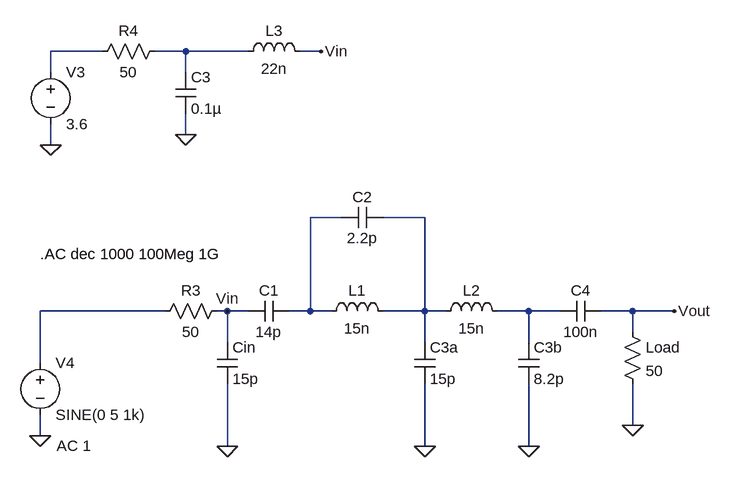
[diagram p0: schematic project front end 433.asc]
project front end 433.asc, the LTspice schematic file:
Version 4
SHEET 1 2444 680
WIRE 240 -224 160 -224
WIRE 368 -224 320 -224
WIRE 464 -224 368 -224
WIRE 576 -224 544 -224
WIRE 160 -192 160 -224
WIRE 368 -192 368 -224
WIRE 368 -96 368 -128
WIRE 160 -80 160 -112
WIRE 608 32 560 32
WIRE 736 32 672 32
WIRE 336 176 144 176
WIRE 432 176 416 176
WIRE 464 176 432 176
WIRE 560 176 560 32
WIRE 560 176 528 176
WIRE 592 176 560 176
WIRE 736 176 736 32
WIRE 736 176 672 176
WIRE 768 176 736 176
WIRE 896 176 848 176
WIRE 944 176 896 176
WIRE 1056 176 1008 176
WIRE 1120 176 1056 176
WIRE 1056 208 1056 176
WIRE 432 224 432 176
WIRE 736 224 736 176
WIRE 896 224 896 176
WIRE 144 256 144 176
WIRE 1056 352 1056 288
WIRE 144 368 144 336
WIRE 432 384 432 288
WIRE 736 384 736 288
WIRE 896 384 896 288
FLAG 736 384 0
FLAG 1056 352 0
FLAG 160 -80 0
FLAG 1120 176 Vout
FLAG 896 384 0
FLAG 432 384 0
FLAG 368 -96 0
FLAG 576 -224 Vin
FLAG 144 368 0
FLAG 432 176 Vin
SYMBOL cap 720 224 R0
SYMATTR InstName C3a
SYMATTR Value 15p
SYMBOL cap 464 192 R270
WINDOW 0 32 32 VTop 2
WINDOW 3 0 32 VBottom 2
SYMATTR InstName C1
SYMATTR Value 14p
SYMBOL cap 608 48 R270
WINDOW 0 32 32 VTop 2
WINDOW 3 0 32 VBottom 2
SYMATTR InstName C2
SYMATTR Value 2.2p
SYMBOL res 1040 192 R0
SYMATTR InstName Load
SYMATTR Value 50
SYMBOL voltage 160 -208 R0
WINDOW 123 25 143 Left 2
WINDOW 39 24 118 Left 2
SYMATTR InstName V3
SYMATTR Value 3.6
SYMBOL res 432 160 R90
WINDOW 0 0 56 VBottom 2
WINDOW 3 32 56 VTop 2
SYMATTR InstName R3
SYMATTR Value 50
SYMBOL ind 576 192 R270
WINDOW 0 32 56 VTop 2
WINDOW 3 5 56 VBottom 2
SYMATTR InstName L1
SYMATTR Value 15n
SYMBOL cap 880 224 R0
SYMATTR InstName C3b
SYMATTR Value 8.2p
SYMBOL cap 416 224 R0
SYMATTR InstName Cin
SYMATTR Value 15p
SYMBOL ind 752 192 R270
WINDOW 0 32 56 VTop 2
WINDOW 3 5 56 VBottom 2
SYMATTR InstName L2
SYMATTR Value 15n
SYMBOL ind 448 -208 R270
WINDOW 0 32 56 VTop 2
WINDOW 3 5 56 VBottom 2
SYMATTR InstName L3
SYMATTR Value 22n
SYMBOL cap 352 -192 R0
SYMATTR InstName C3
SYMATTR Value 0.1µ
SYMBOL voltage 144 240 R0
WINDOW 123 25 143 Left 2
WINDOW 39 24 118 Left 2
SYMATTR Value2 AC 1
SYMATTR InstName V4
SYMATTR Value SINE(0 5 1k)
SYMBOL res 336 -240 R90
WINDOW 0 0 56 VBottom 2
WINDOW 3 32 56 VTop 2
SYMATTR InstName R4
SYMATTR Value 50
SYMBOL cap 1008 160 R90
WINDOW 0 0 32 VBottom 2
WINDOW 3 32 32 VTop 2
SYMATTR InstName C4
SYMATTR Value 100n
TEXT 144 88 Left 2 !.AC dec 1000 100Meg 1G

The netlist it stands for:
* project front end 433.asc
C3a N004 0 15p
C1 Vin N003 14p
C2 N003 N004 2.2p
R§Load Vout 0 50
V3 N001 0 3.6
R3 Vin N005 50
L1 N003 N004 15n
C3b N006 0 8.2p
Cin Vin 0 15p
L2 N004 N006 15n
L3 N002 Vin 22n
C3 N002 0 0.1µ
V4 N005 0 SINE(0 5 1k) AC 1
R4 N002 N001 50
C4 Vout N006 100n
.AC dec 1000 100Meg 1G
.backanno
.end